# EAGLE design OBD-UART (EAGLE 9.6.2)
DESCRIPTION: microOBD 200 OBD-II Module; HW_REV: 1.4; PCB_REV: C; PCB_SPEC1: Layer Count: 4; PCB_SPEC2: Size: 1.3" x 0.59"; PCB_SPEC3: Finish Thickness: 0.049" - 0.052"; PCB_SPEC4: Copper Weight: 1oz; TITLE: STM1120

## Sheet 1 of 4
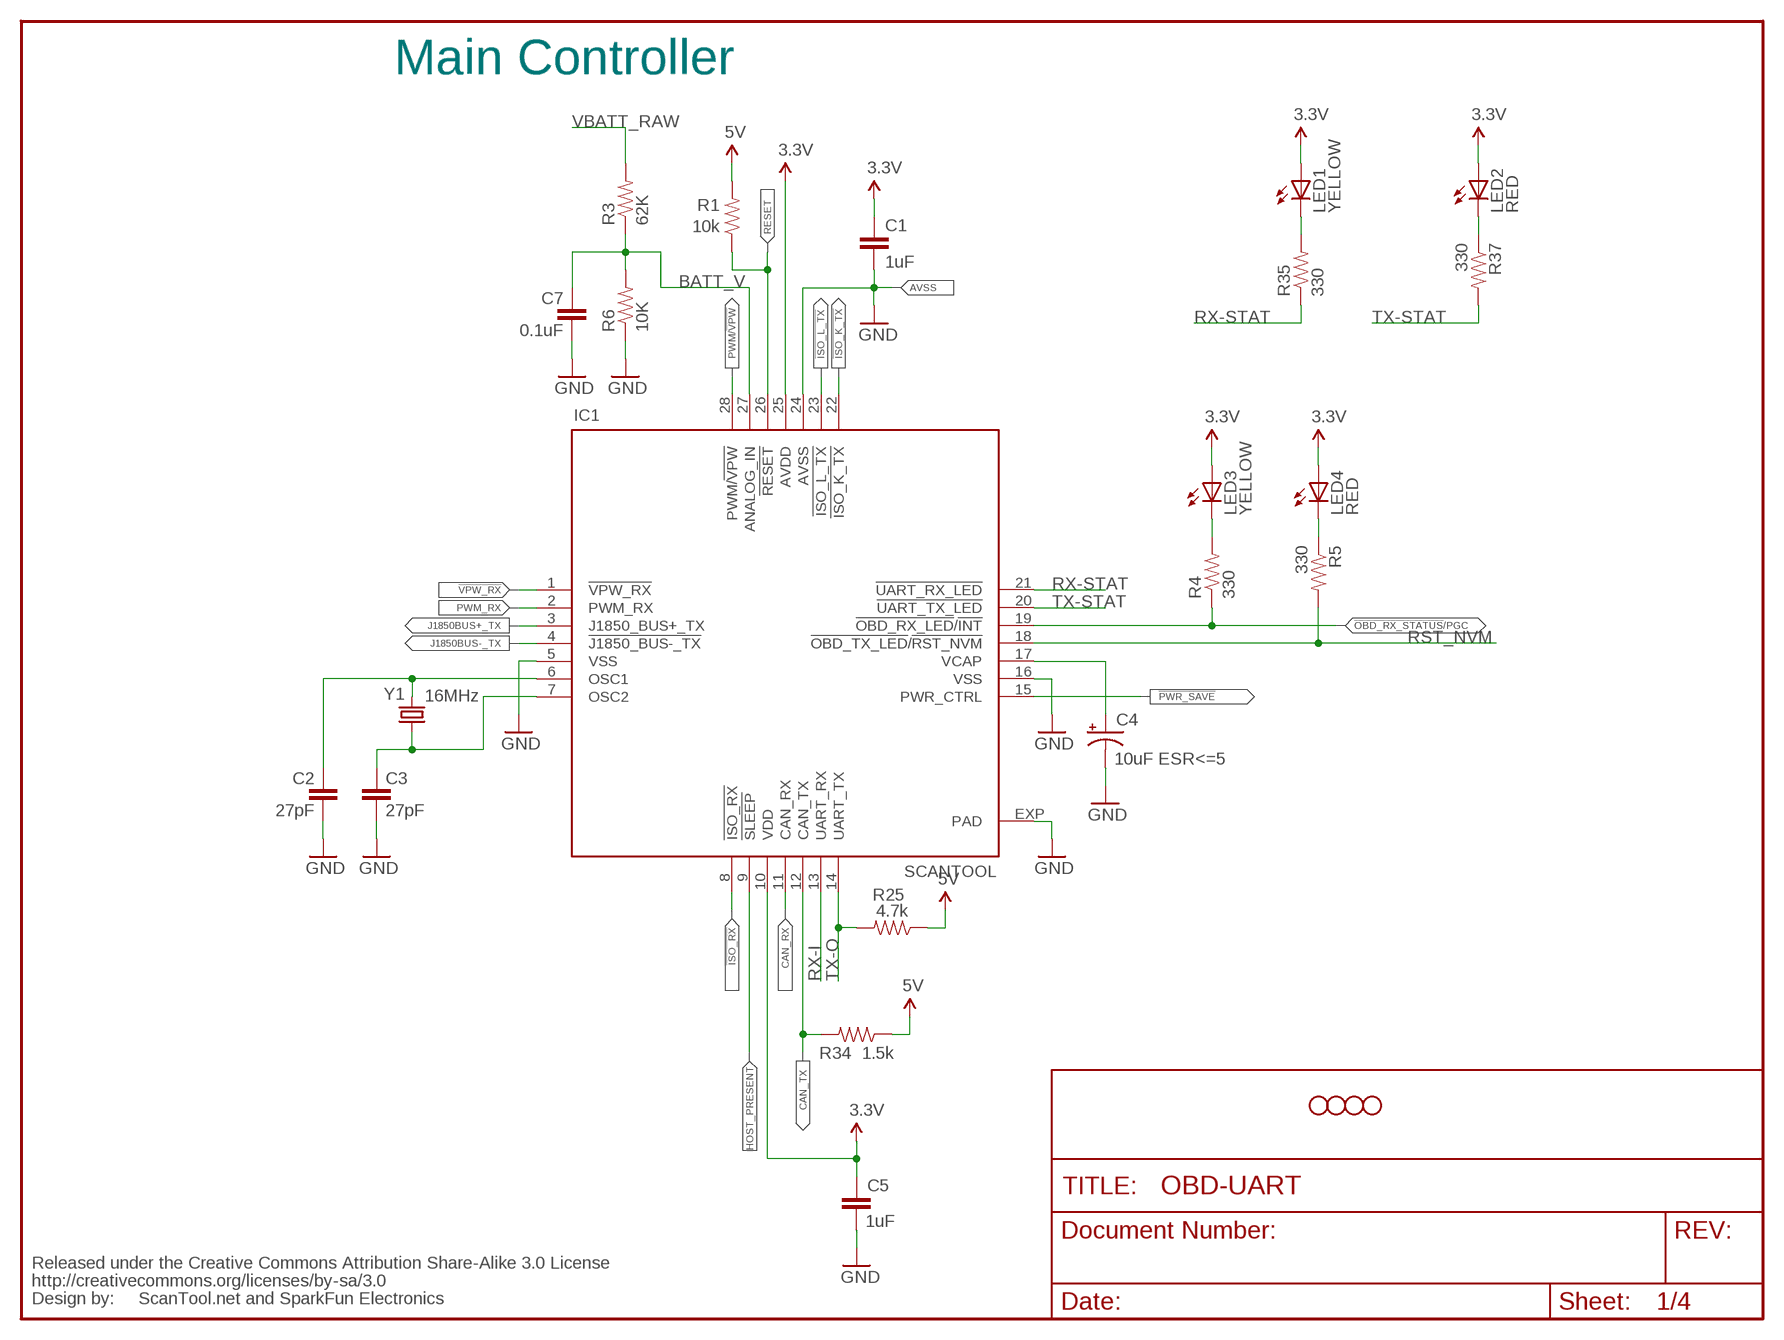
[diagram p0: schematic, sheet 1]

### Parts
C1  1uF  CAP0402-CAP  [0402-CAP]
C2  27pF  CAP0402-CAP  [0402-CAP]
C3  27pF  CAP0402-CAP  [0402-CAP]
C4  10uF ESR<=5  CAP_POL1206  [EIA3216]
C5  1uF  CAP0402-CAP  [0402-CAP]
C7  0.1uF  CAP0402-CAP  [0402-CAP]
IC1  SCANTOOL  [_STN_SCANTOOL_QFN-28-S]
JP4  STAND-OFF  [STAND-OFF]
JP5  STAND-OFF  [STAND-OFF]
JP6  STAND-OFF  [STAND-OFF]
JP7  STAND-OFF  [STAND-OFF]
LED1  YELLOW  LED0603  [LED-0603]
LED2  RED  LED0603  [LED-0603]
LED3  YELLOW  LED0603  [LED-0603]
LED4  RED  LED0603  [LED-0603]
R1  10k  RESISTOR0402-RES  [0402-RES]
R3  62K  RESISTOR0402-RES  [0402-RES]
R4  330  RESISTOR0402-RES  [0402-RES]
R5  330  RESISTOR0402-RES  [0402-RES]
R6  10K  RESISTOR0402-RES  [0402-RES]
R25  4.7k  RESISTOR0402-RES  [0402-RES]
R34  1.5k  RESISTOR0402-RES  [0402-RES]
R35  330  RESISTOR0402-RES  [0402-RES]
R37  330  RESISTOR0402-RES  [0402-RES]
U$1  CREATIVE_COMMONS  [CREATIVE_COMMONS]
Y1  16MHz  CRYSTAL5X3  [CRYSTAL-SMD-5X3]

### Nets
3.3V [highpower]: C1.1 C5.1 IC1.10(VDD) IC1.25(AVDD) LED1.A LED2.A LED3.A LED4.A ; also sheet 2,3,4
5V [highpower]: R1.2 R25.1 R34.1 ; also sheet 2,3,4
!ISO_K_TX: IC1.22(!ISO_K_TX) ; also sheet 3
!ISO_L_TX: IC1.23(!ISO_L_TX) ; also sheet 3
!ISO_RX: IC1.8(!ISO_RX) ; also sheet 3
!OBD_RX_STATUS!/PGC: IC1.19(!OBD_RX_LED!/!INT) R4.1
!PWR_SAVE: IC1.15(PWR_CTRL)
!VPW_RX: IC1.1(!VPW_RX) ; also sheet 4
BATT_V [highpower]: C7.1 IC1.27(ANALOG_IN) R3.1 R6.2
CAN_RX: IC1.11(CAN_RX) ; also sheet 3
CAN_TX: IC1.12(CAN_TX) R34.2 ; also sheet 3
GND: C1.2 C2.2 C3.2 C4.C(-) C5.2 C7.2 IC1.5(VSS) IC1.16(VSS) IC1.24(AVSS) IC1.EXP(PAD) R6.1 ; also sheet 2,3,4
HOST_PRESENT: IC1.9(!SLEEP)
J1850BUS+_TX: IC1.3(J1850_BUS+_TX) ; also sheet 4
J1850BUS-_TX: IC1.4(!J1850_BUS-_TX) ; also sheet 4
N$26: C4.A(+) IC1.17(VCAP)
N$30: LED3.C R4.2
N$31: LED4.C R5.1
N$35: LED1.C R35.2
N$36: LED2.C R37.1
OSC1: C2.1 IC1.6(OSC1) Y1.3
OSC2: C3.1 IC1.7(OSC2) Y1.1
PWM/!VPW: IC1.28(PWM/!VPW) ; also sheet 4
PWM_RX: IC1.2(PWM_RX) ; also sheet 4
RESET: IC1.26(!RESET) R1.1
RST_NVM: IC1.18(!OBD_TX_LED!/!RST_NVM) R5.2
RX-I: IC1.13(UART_RX) ; also sheet 2
RX-STAT: IC1.21(!UART_RX_LED) R35.1
TX-O: IC1.14(UART_TX) R25.2 ; also sheet 2
TX-STAT: IC1.20(!UART_TX_LED) R37.2
VBATT_RAW [highpower]: R3.2 ; also sheet 2

### Notes on the sheet
- Main Controller
- AVSS
- ScanTool.net and SparkFun Electronics

## Sheet 2 of 4
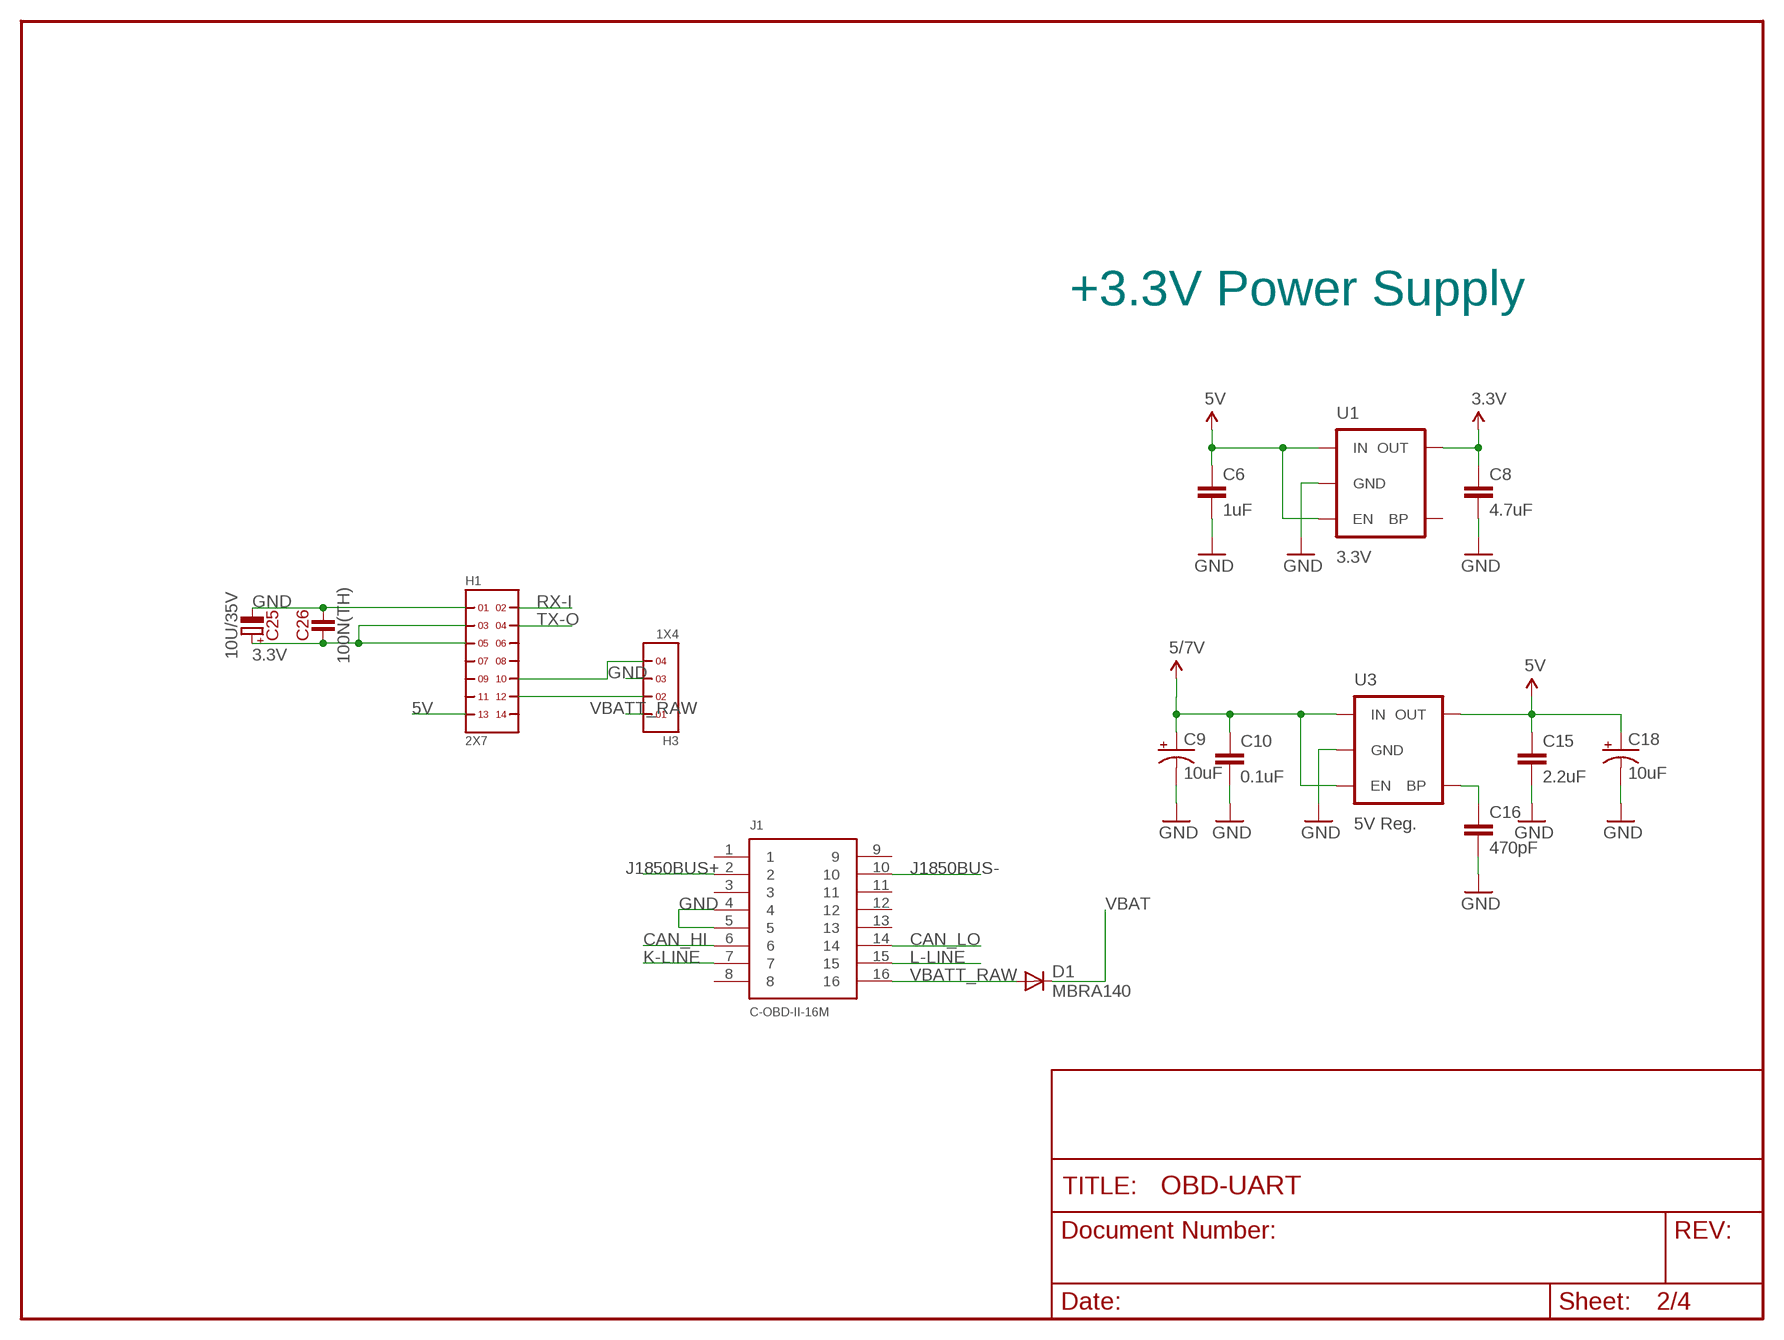
[diagram p1: schematic, sheet 2]

### Parts
C6  1uF  CAP0402-CAP  [0402-CAP]
C8  4.7uF  CAP0402-CAP  [0402-CAP]
C9  10uF  CAP_POL1206  [EIA3216]
C10  0.1uF  CAP0402-CAP  [0402-CAP]
C15  2.2uF  CAP0402-CAP  [0402-CAP]
C16  470pF  CAP0402-CAP  [0402-CAP]
C18  10uF  CAP_POL1206  [EIA3216]
C25  10U/35V  [E2-5]
C26  100N(TH)  [C050-024X044]
D1  MBRA140  DIODESMA  [SMA-DIODE]
H1  2X7  [2X7]
H3  1X4  [1X4]
J1  C-OBD-II-16M  [COMTECH_C-OBD-II-16M]
U1  3.3V  V_REG_LDOSMD  [SOT23-5]
U3  5V Reg.  V_REG_LDOSMD  [SOT23-5]

### Nets
3.3V [highpower]: C8.1 C25.+ C26.1 H1.3 H1.5 U1.5(OUT) ; also sheet 1,3,4
5V [highpower]: C6.1 C15.1 C18.A(+) H1.13 U1.1(IN) U1.3(EN) U3.5(OUT) ; also sheet 1,3,4
CAN_HI: J1.6 ; also sheet 3
CAN_LO: J1.14 ; also sheet 3
GND: C6.2 C8.2 C9.C(-) C10.2 C15.2 C16.2 C18.C(-) C25.- C26.2 H1.1 H3.3 J1.4 J1.5 U1.2(GND) U3.2(GND) ; also sheet 1,3,4
J1850BUS+: J1.2 ; also sheet 4
J1850BUS-: J1.10 ; also sheet 4
K-LINE: J1.7 ; also sheet 3
L-LINE: J1.15 ; also sheet 3
N$17: H1.10 H3.4
N$20: H1.12 H3.2
N$34: C16.1 U3.4(BP)
RX-I: H1.2 ; also sheet 1
TX-O: H1.4 ; also sheet 1
VBAT [highpower]: D1.C ; also sheet 3,4
VBATT_RAW [highpower]: D1.A H3.1 J1.16 ; also sheet 1
VCC [highpower]: C9.A(+) C10.1 U3.1(IN) U3.3(EN) ; supply symbol labelled 5/7V ; also sheet 4
Unconnected: H1.6 H1.7 H1.8 H1.9 H1.11 H1.14 J1.1 J1.3 J1.8 J1.9 J1.11 J1.12 J1.13 U1.4(BP)

### Notes on the sheet
- +3.3V Power Supply

## Sheet 3 of 4
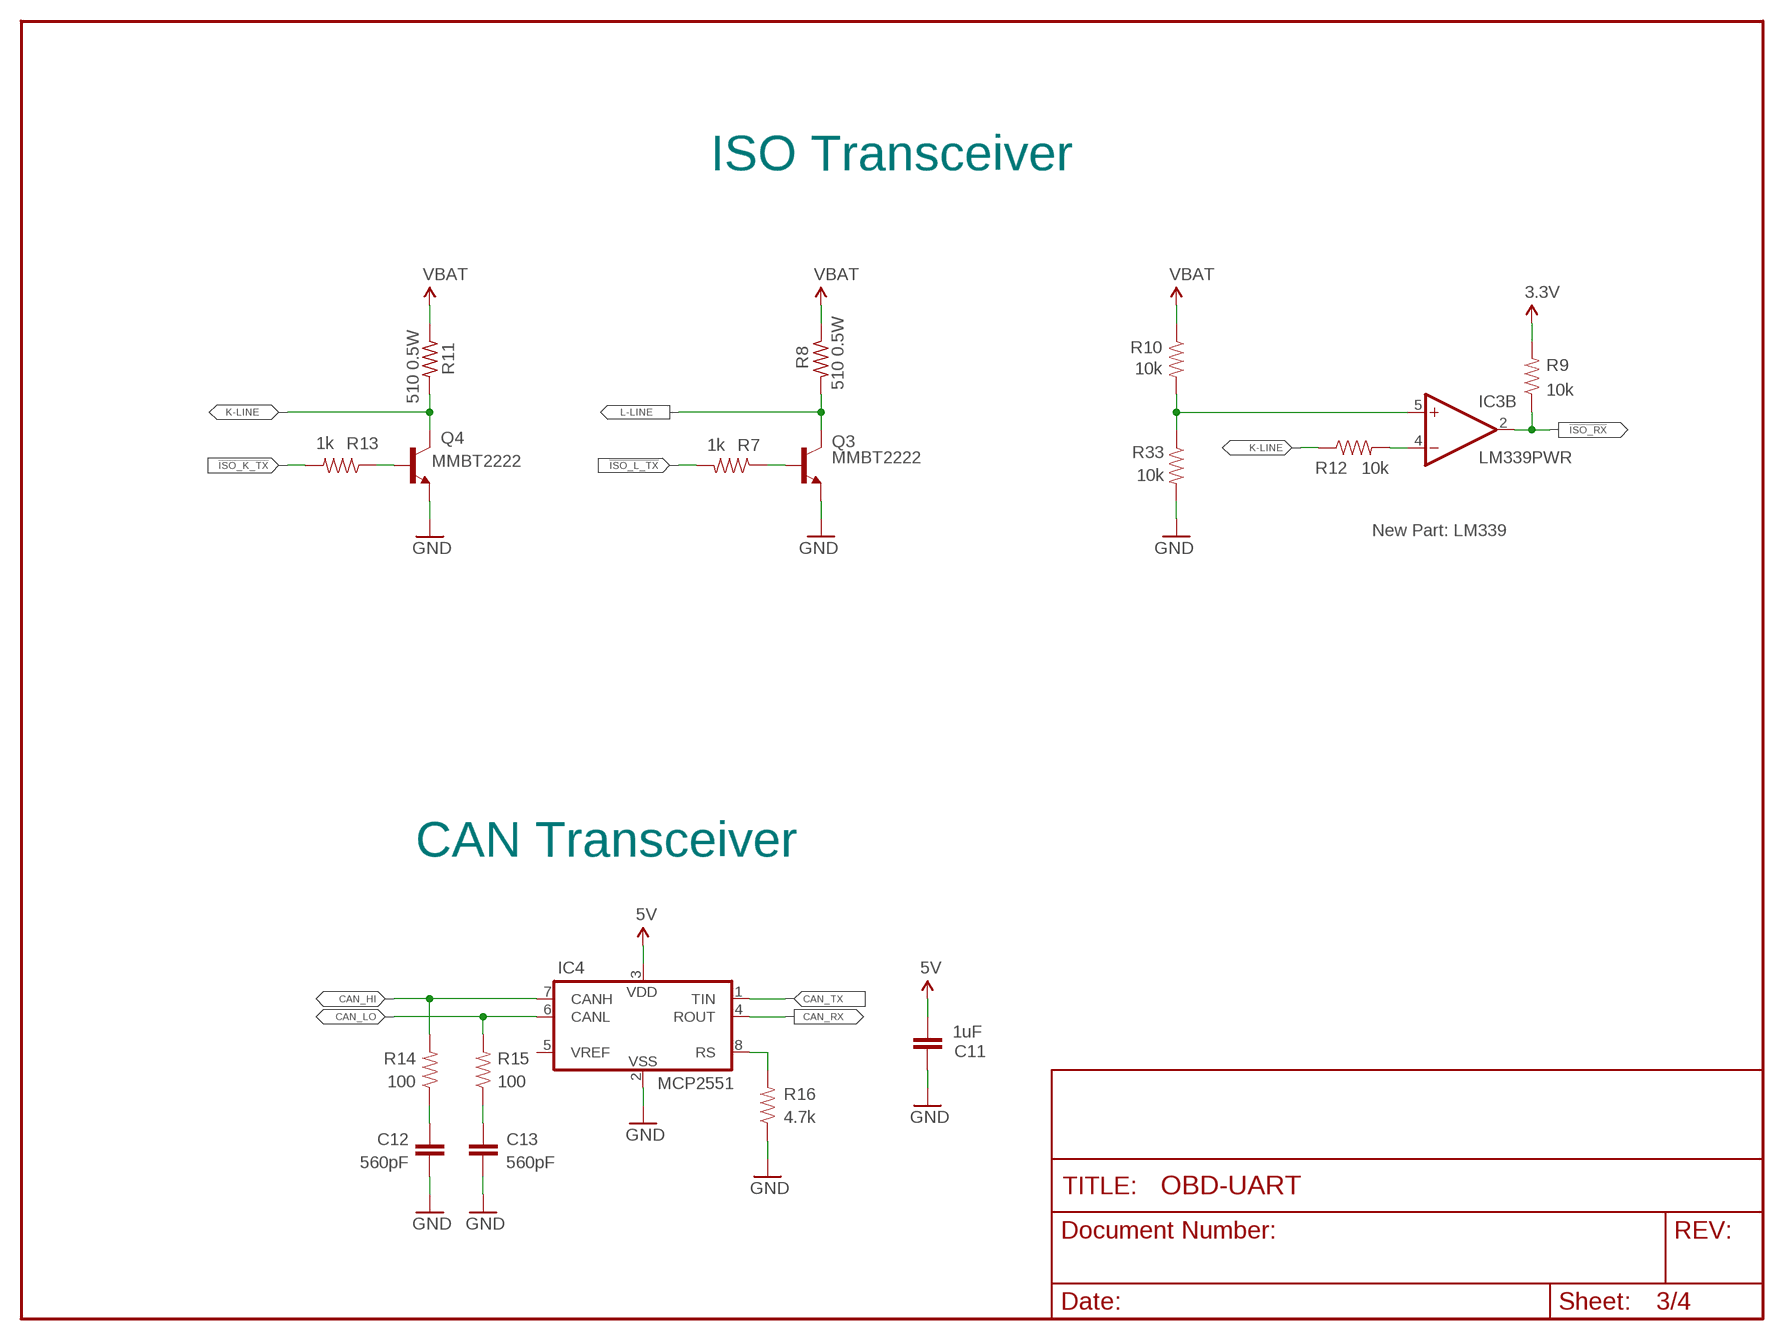
[diagram p2: schematic, sheet 3]

### Parts
C11  1uF  CAP0402-CAP  [0402-CAP]
C12  560pF  CAP0402-CAP  [0402-CAP]
C13  560pF  CAP0402-CAP  [0402-CAP]
IC3  LM339PWR  [TSSOP-14]
IC4  MCP2551  MCP2551-I/SN  [SO-8]
Q3  MMBT2222  TRANSISTOR_NPNSOT23-3  [SOT23-3]
Q4  MMBT2222  TRANSISTOR_NPNSOT23-3  [SOT23-3]
R7  1k  RESISTOR0402-RES  [0402-RES]
R8  510 0.5W  R-US_2010  [2010]
R9  10k  RESISTOR0402-RES  [0402-RES]
R10  10k  RESISTOR0402-RES  [0402-RES]
R11  510 0.5W  R-US_2010  [2010]
R12  10k  RESISTOR0402-RES  [0402-RES]
R13  1k  RESISTOR0402-RES  [0402-RES]
R14  100  RESISTOR0402-RES  [0402-RES]
R15  100  RESISTOR0402-RES  [0402-RES]
R16  4.7k  RESISTOR0402-RES  [0402-RES]
R33  10k  RESISTOR0402-RES  [0402-RES]

### Nets
3.3V [highpower]: R9.2 ; also sheet 1,2,4
5V [highpower]: C11.1 IC4.3(VDD) ; also sheet 1,2,4
!ISO_K_TX: R13.2 ; also sheet 1
!ISO_L_TX: R7.2 ; also sheet 1
!ISO_RX: IC3.2(B:OUT) R9.1 ; also sheet 1
CAN_HI: IC4.7(CANH) R14.2 ; also sheet 2
CAN_LO: IC4.6(CANL) R15.2 ; also sheet 2
CAN_RX: IC4.4(ROUT) ; also sheet 1
CAN_TX: IC4.1(TIN) ; also sheet 1
GND: C11.2 C12.2 C13.2 IC4.2(VSS) Q3.2(E) Q4.2(E) R16.1 R33.2 ; also sheet 1,2,4
K-LINE: Q4.3(C) R11.2 R12.1 ; also sheet 2
L-LINE: Q3.3(C) R8.2 ; also sheet 2
N$4: Q4.1(B) R13.1
N$5: Q3.1(B) R7.1
N$6: IC3.5(B:+IN) R10.2 R33.1
N$10: C12.1 R14.1
N$11: IC4.8(RS) R16.2
N$13: IC3.4(B:-IN) R12.2
N$27: C13.1 R15.1
VBAT [highpower]: R8.1 R10.1 R11.1 ; also sheet 2,4
Unconnected: IC3.10(D:-IN) IC3.11(D:+IN) IC3.13(D:OUT) IC4.5(VREF)

### Notes on the sheet
- ISO Transceiver
- New Part: LM339
- CAN Transceiver

## Sheet 4 of 4
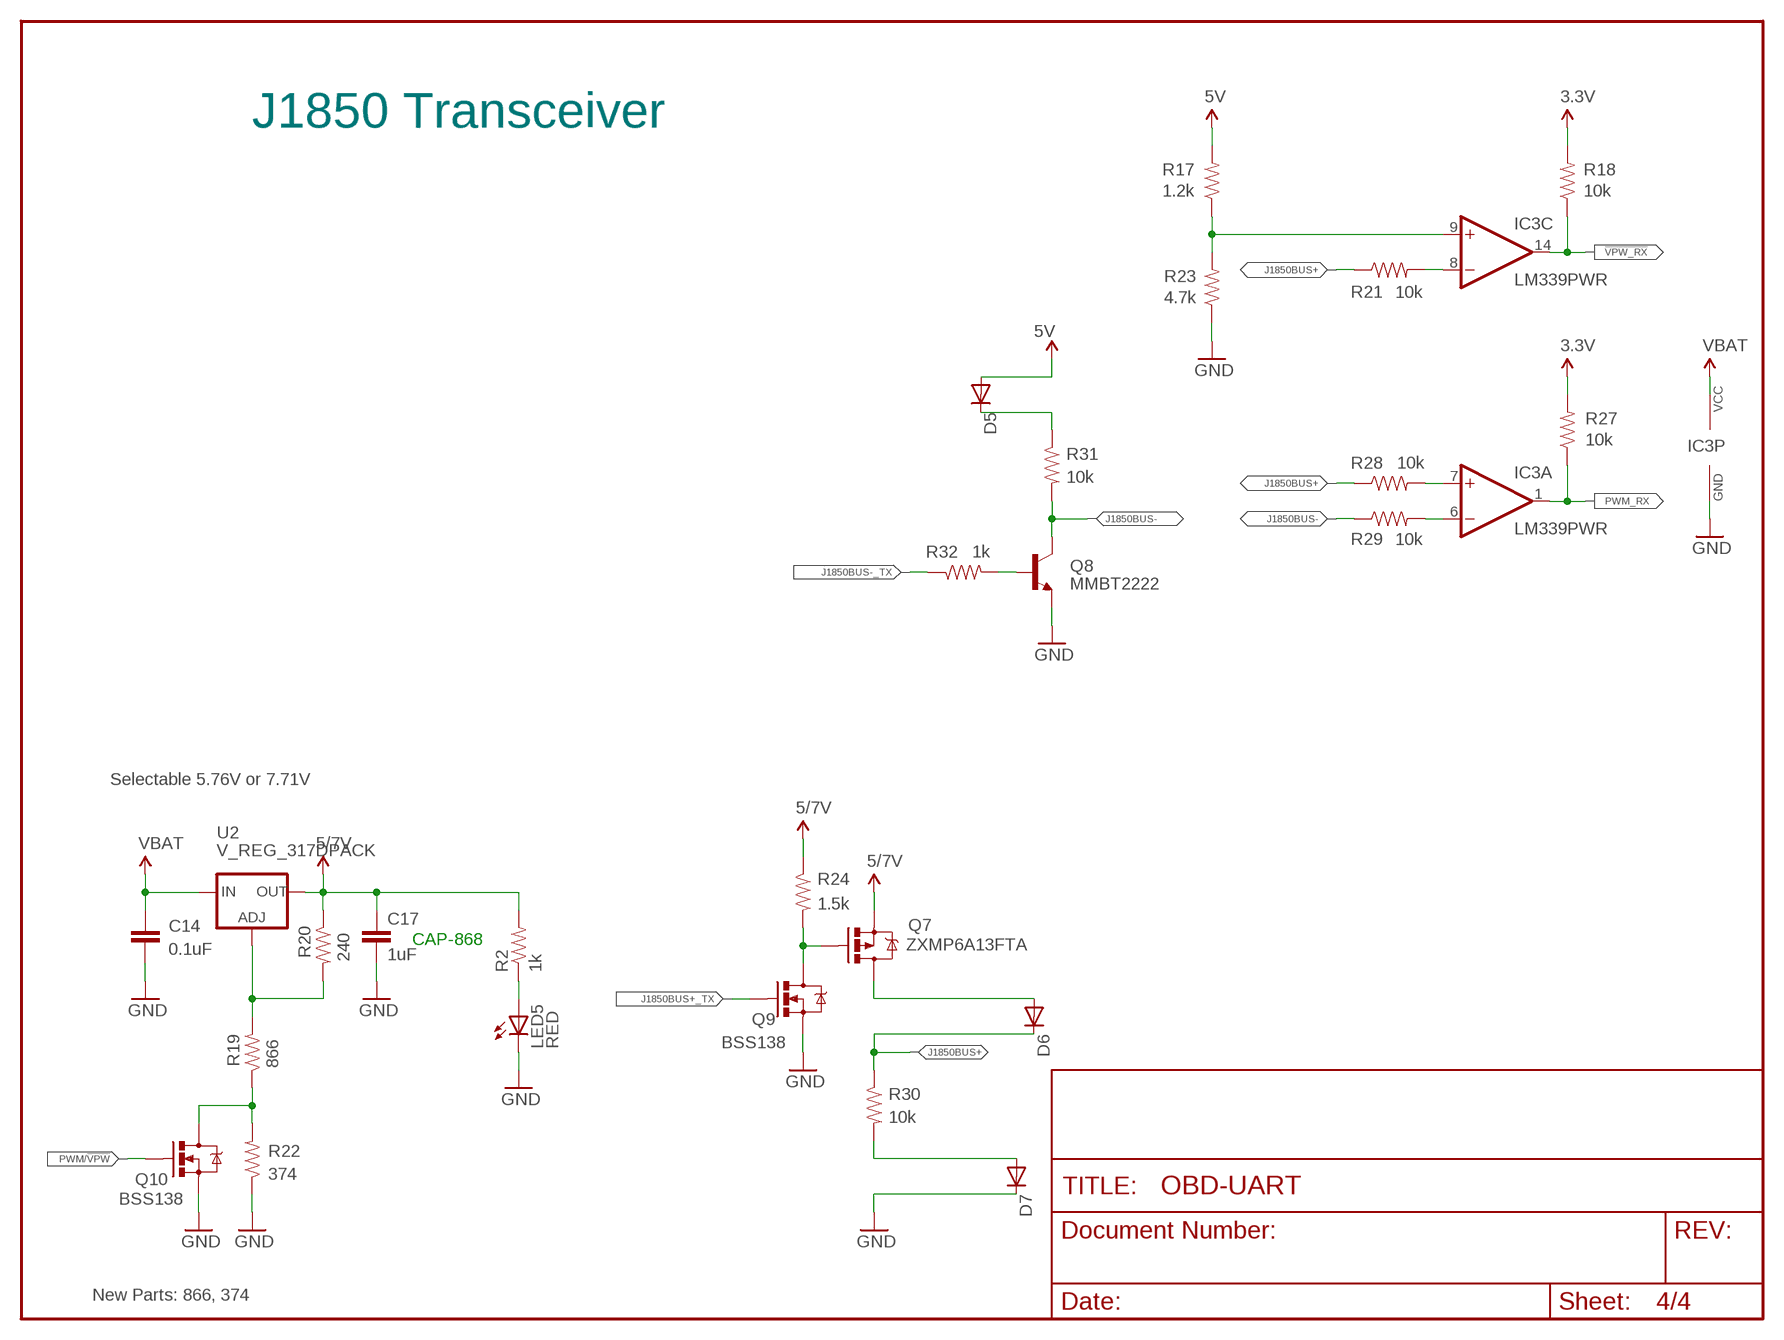
[diagram p3: schematic, sheet 4]

### Parts
C14  0.1uF  CAP0402-CAP  [0402-CAP]
C17  1uF  CAP0402-CAP  [0402-CAP]
D5  DIODESOT23  [SOT23-3]
D6  DIODESOT23  [SOT23-3]
D7  DIODESOT23  [SOT23-3]
LED5  RED  LED0603  [LED-0603]
Q7  ZXMP6A13FTA  MOSFET-PCHANNEL  [SOT23]
Q8  MMBT2222  TRANSISTOR_NPNSOT23-3  [SOT23-3]
Q9  BSS138  MOSFET-NCHANNELSMD  [SOT23-3]
Q10  BSS138  MOSFET-NCHANNELSMD  [SOT23-3]
R2  1k  RESISTOR0402-RES  [0402-RES]
R17  1.2k  RESISTOR0402-RES  [0402-RES]
R18  10k  RESISTOR0402-RES  [0402-RES]
R19  866  RESISTOR0402-RES  [0402-RES]
R20  240  RESISTOR0402-RES  [0402-RES]
R21  10k  RESISTOR0402-RES  [0402-RES]
R22  374  RESISTOR0402-RES  [0402-RES]
R23  4.7k  RESISTOR0402-RES  [0402-RES]
R24  1.5k  RESISTOR0402-RES  [0402-RES]
R27  10k  RESISTOR0402-RES  [0402-RES]
R28  10k  RESISTOR0402-RES  [0402-RES]
R29  10k  RESISTOR0402-RES  [0402-RES]
R30  10k  RESISTOR0402-RES  [0402-RES]
R31  10k  RESISTOR0402-RES  [0402-RES]
R32  1k  RESISTOR0402-RES  [0402-RES]
U2  V_REG_317DPACK  [V-REG_DPACK]

### Nets
3.3V [highpower]: R18.2 R27.2 ; also sheet 1,2,3
5V [highpower]: D5.1(A) R17.2 ; also sheet 1,2,3
!VPW_RX: IC3.14(C:OUT) R18.1 ; also sheet 1
GND: C14.2 C17.2 D7.3(C) IC3.12(P:GND) LED5.C Q8.2(E) Q9.2(S) Q10.2(S) R22.1 R23.1 ; also sheet 1,2,3
J1850BUS+: D6.3(C) R21.1 R28.1 R30.1 ; also sheet 2
J1850BUS+_TX: Q9.1(G) ; also sheet 1
J1850BUS-: Q8.3(C) R29.1 R31.2 ; also sheet 2
J1850BUS-_TX: R32.1 ; also sheet 1
N$1: IC3.7(A:+IN) R28.2
N$3: IC3.6(A:-IN) R29.2
N$7: IC3.8(C:-IN) R21.2
N$8: R19.2 R20.2 U2.1(ADJ)
N$9: D6.1(A) Q7.3(D)
N$12: IC3.9(C:+IN) R17.1 R23.2
N$14: D5.3(C) R31.1
N$18: Q7.1(G) Q9.3(D) R24.2
N$22: Q10.3(D) R19.1 R22.2
N$24: D7.1(A) R30.2
N$25: Q8.1(B) R32.2
N$32: LED5.A R2.1
PWM/!VPW: Q10.1(G) ; also sheet 1
PWM_RX: IC3.1(A:OUT) R27.1 ; also sheet 1
VBAT [highpower]: C14.1 IC3.3(P:VCC) U2.3(IN) ; also sheet 2,3
VCC [highpower]: C17.1 Q7.2(S) R2.2 R20.1 R24.1 U2.4(OUT) ; supply symbol labelled 5/7V ; also sheet 2

### Notes on the sheet
- J1850 Transceiver
- Selectable 5.76V or 7.71V
- CAP-868
- New Parts: 866, 374

## Library data of the parts
C1-C3 C5-C8 C10-C17 = SparkFun:CAP: Capacitor Standard 0603 ceramic capacitor, and 0.1" leaded capacitor.
C4 C9 C18 = SparkFun:CAP_POL: Capacitor Polarized These are standard SMD and PTH capacitors. Normally 10uF, 47uF, and 100uF in electrolytic and tantalum varieties. Always verify the external diameter of the through hole cap, it varies with capacity, voltage, and manufacturer. The EIA devices should be standard.
C25 = capacitors-electrolytic:?; MOUSER: 647-USW1V100MDD
C26 = capacitors:?; MOUSER: 81-RCER71H104K0A2H3B
D1 D5-D7 = SparkFun:DIODE: Diode These are standard reverse protection diodes and small signal diodes. SMA package can handle up to about 1A. SOD-323 can handle about 200mA. What the SOD-323 package when ordering, there are some mfgs out there that are 5-pin packages.
H1 = headers(.1in):2X7
H3 = headers(.1in):1X4
IC1 = SparkFun:SCANTOOL: STN1110 - Multiprotocol OBD II to UART Interpreter, QFN Package Change Log Date Author Change Aug 23, 2010 vit@scantool.net Created device
IC3 = _stn_logic:LM339PWR: Quad Differential Comparators Based on information from the SLCS006N datasheet from TI (www.ti.com). Change Log Date Author Change July 16, 2008 nick@scantool.net Device created.; DESC: IC, Quad Comparator; MANUF: Texas Instruments; PARTNUM: LM339PWR; SUPPLIER: Digikey:296-6607-1-ND; VALSTAT: PARTNUM
IC4 = _stn_microchip:MCP2551: CAN Driver Based on information from the MPC2551 datasheet from Microchip. http://www.microchip.com/ Change Log Date Author Change November 12, 2008 joe@scantool.net Renamed "TXD" to "TIN" and "RXD" to "ROUT" Fixed mislabeled pins "CANH" and CANL"; DESC: IC, CAN Transceiver; MANUF: Microchip Technology; PARTNUM: MCP2551-I/SN; SUPPLIER: Digikey:MCP2551-I/SN-ND; VALSTAT: PARTNUM
J1 = C-OBD-II-16M:C-OBD-II-16M: OBD II 16pin 90 Degree Angle Male Plug Connector Check availability <https://pricing.snapeda.com/parts/C-OBD-II-16M/Comtech%20Electronic%20Co.%2C%20LTD/view-part?ref=eda>; AVAILABILITY: Not in stock; DESCRIPTION: OBD II 16pin 90 Degree Angle Male Plug Connector; MF: Comtech Electronic Co., LTD; MP: C-OBD-II-16M; PACKAGE: None; PRICE: None
JP4-JP7 = SparkFun:STAND-OFF: Stand Off This is the mechanical footprint for a #4 phillips button head screw. Use the keepout ring to avoid running the screw head into surrounding components. SKU : PRT-00447
LED1-LED5 = SparkFun:LED: LEDs Standard schematic elements and footprints for 5mm, 3mm, 1206, and 0603 sized LEDs. 5mm - Spark Fun Electronics SKU : COM-00529 (and others)
Q3 Q4 Q8 = SparkFun:TRANSISTOR_NPN: Transistor NPN BJT configuration in SOT23 package. MMBT2222 is the common NPN we use. Double check BCE configuration again layout.
Q7 = SparkFun:MOSFET-PCHANNEL
Q9 Q10 = SparkFun:MOSFET-NCHANNEL
R1-R7 R9 R10 R12-R25 R27-R35 R37 = SparkFun:RESISTOR: Resistor Basic schematic elements and footprints for 0603, 1206, and PTH resistors.
R8 R11 = _stn_rcl:R-US: Resistor, US Symbol Change Log Date Author Change November 13, 2006 vit@scantool.net Moved underscore from the end of device name to beginning of variant names. May 27, 2006 vitaliy@scantool.net Added description.; DESC: Resistor; VALSTAT: VAL
U1 U3 = SparkFun:V_REG_LDO: Voltage Regulator LDO Standard 150mA LDO voltage regulator in SOT-23 layout. Micrel part MIC5205. BP (by-pass) pin is used to lower output noise with 470pF cap.
U2 = SparkFun:V_REG_317: Voltage Regulator Standard LM317 adjustable voltage regulator. AOI (Adjust Output Input). Google 'LM317 Calculator' for easy to use app to get the two resistor values needed. 240/720 for 5V output. 240/390 for 3.3V output. Spark Fun Electronics SKU : COM-00527
U$1 = SparkFun:CREATIVE_COMMONS
Y1 = SparkFun:CRYSTAL: Crystals Various standard crystals. Proven footprints. Spark Fun Electronics SKU : COM-00534

## Net classes
1 highpower: width 0.305 mm

## Board
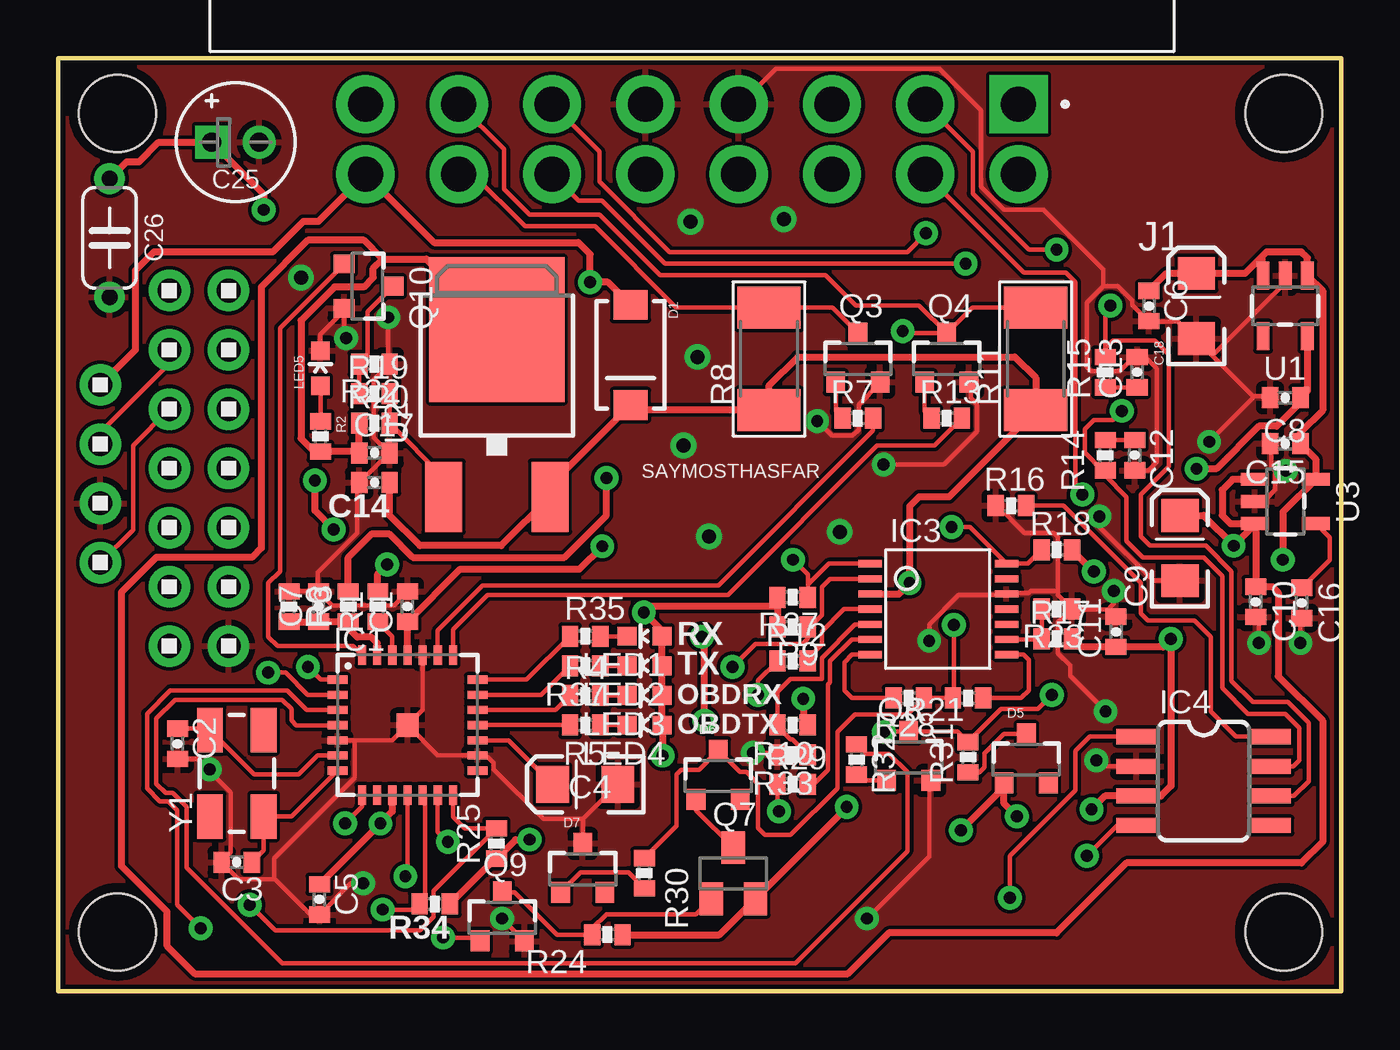
[diagram p4: board, top side]
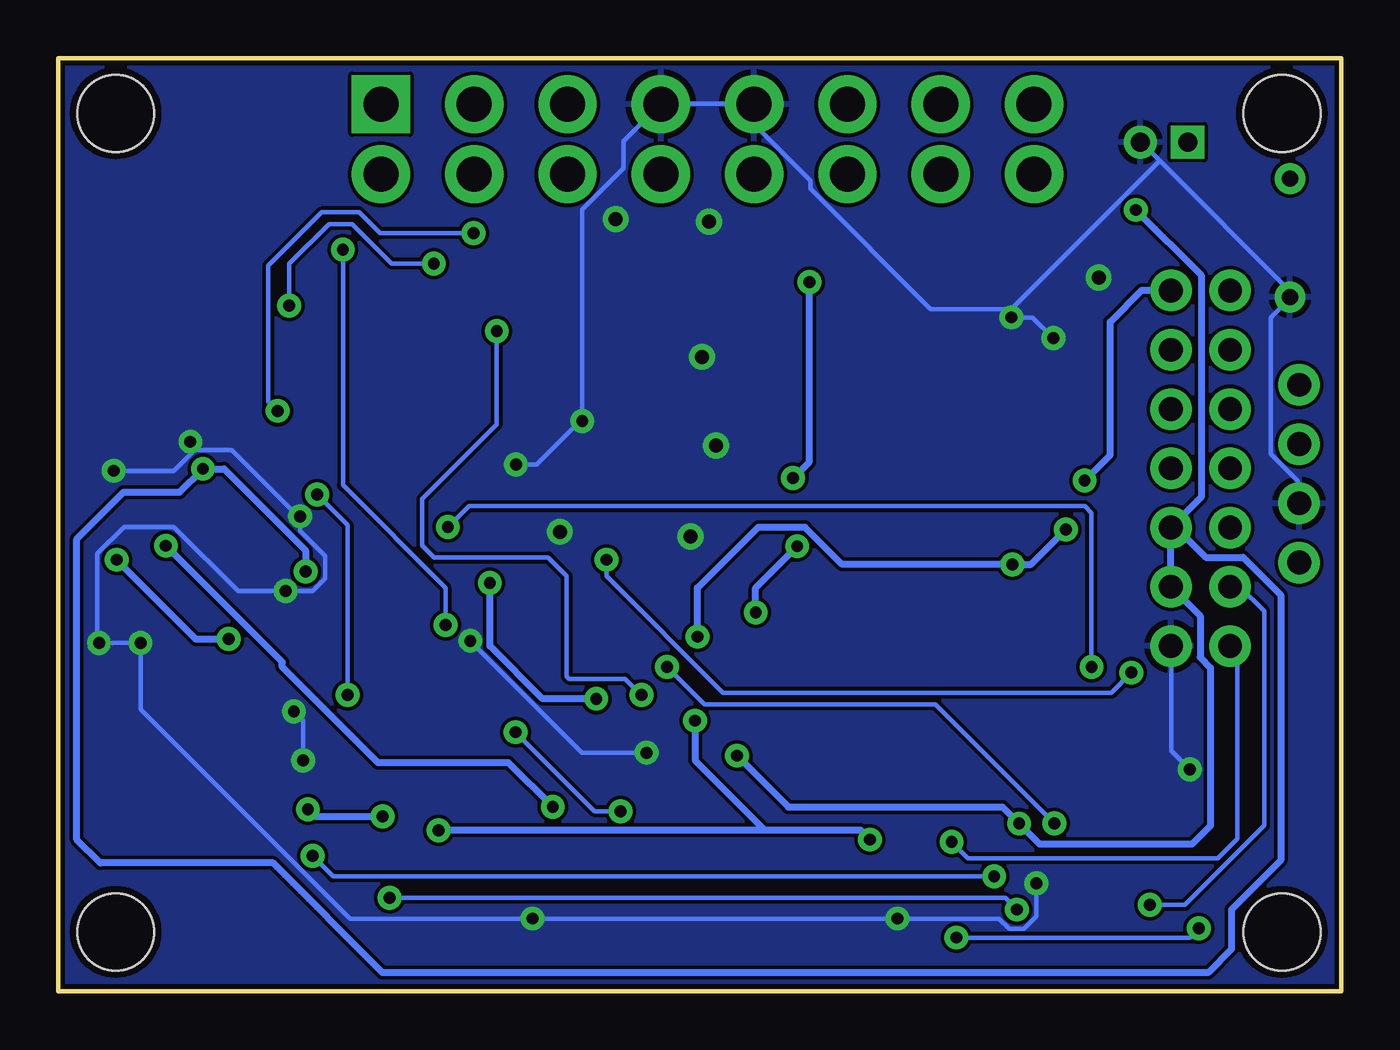
[diagram p5: board, bottom side, seen from below]

Size 55 x 40 mm. Coordinates in mm from the lower left corner, seen from the top.
Outline: 0,0 55,0 55,40 0,40 0,0
Copper layers (1*16): Top 0.035mm / dielectric 1.5mm / Bottom 0.035mm
Design rules "SparkFun *": minimum track width 8mil, minimum drill 20mil, track to track 6mil, track to pad 6mil, pad to pad 6mil, via to via 6mil, smd to smd 6mil, copper to edge 8mil, drill to drill 8mil, minimum pad ring 12mil, minimum via ring 10mil, stop-mask expansion 4mil, vias tented up to drill 20mil, thermal gap 10mil
Milling: 4 lines

### Footprints (pad centres in the part's own frame; a part is rotated, then mirrored left to right if it is on the bottom)
0402-CAP = smd 0.7 x 0.9: 1 -0.65,0; 2 0.65,0
EIA3216 = smd 1.4 x 1.6: A 1.4,0; C -1.4,0
E2-5 = drill 0.813 square: + -1.016,0 | drill 0.813: - 1.016,0
C050-024X044 = drill 0.7: 1 -2.54,0; 2 2.54,0
SMA-DIODE = smd 1.27 x 1.47: A -2.15,0; C 2.15,0
SOT23-3 = smd 0.8 x 0.9: 1 -0.95,-1; 2 0.95,-1; 3 0,1.1
2X7 = drill 1.016 pad 1.778: 1 0,0; 2 0,2.54; 3 2.54,0; 4 2.54,2.54; 5 5.08,0; 6 5.08,2.54; 7 7.62,0; 8 7.62,2.54; 9 10.16,0; 10 10.16,2.54; 11 12.7,0; 12 12.7,2.54; 13 15.24,0; 14 15.24,2.54
1X4 = drill 1.016 pad 1.778: 1 0,0; 2 2.54,0; 3 5.08,0; 4 7.62,0
_STN_SCANTOOL_QFN-28-S = smd 0.85 x 0.35: 1 -3,1.95; 2 -3,1.3; 3 -3,0.65; 4 -3,0; 5 -3,-0.65; 6 -3,-1.3; 7 -3,-1.95; 15 3,-1.95; 16 3,-1.3; 17 3,-0.65; 18 3,0; 19 3,0.65; 20 3,1.3; 21 3,1.95 | smd 0.35 x 0.85: 8 -1.95,-3; 9 -1.3,-3; 10 -0.65,-3; 11 0,-3; 12 0.65,-3; 13 1.3,-3; 14 1.95,-3; 22 1.95,3; 23 1.3,3; 24 0.65,3; 25 0,3; 26 -0.65,3; 27 -1.3,3; 28 -1.95,3 | smd 1 x 1: EXP 0,0
TSSOP-14 = smd 0.305 x 0.991: 1 -1.95,-2.925; 2 -1.3,-2.925; 3 -0.65,-2.925; 4 0,-2.925; 5 0.65,-2.925; 6 1.3,-2.925; 7 1.95,-2.925; 8 1.95,2.925; 9 1.3,2.925; 10 0.65,2.925; 11 0,2.925; 12 -0.65,2.925; 13 -1.3,2.925; 14 -1.95,2.925
SO-8 = smd 0.65 x 1.75: 1 -1.905,-2.873; 2 -0.635,-2.873; 3 0.635,-2.873; 4 1.905,-2.873; 5 1.905,2.873; 6 0.635,2.873; 7 -0.635,2.873; 8 -1.905,2.873
COMTECH_C-OBD-II-16M = drill 1.5 pad 2.5 square: 1 0,0 | drill 1.5 pad 2.5: 2 4,0; 3 8,0; 4 12,0; 5 16,0; 6 20,0; 7 24,0; 8 28,0; 9 0,3; 10 4,3; 11 8,3; 12 12,3; 13 16,3; 14 20,3; 15 24,3; 16 28,3
STAND-OFF = hole 3.302: 0,0
LED-0603 = smd 0.8 x 0.8: A 0,-0.75; C 0,0.75
SOT23 = smd 1 x 1.4: 1 -0.95,-1.1; 2 0.95,-1.1; 3 0,1.1
0402-RES = smd 0.7 x 0.9: 1 -0.65,0; 2 0.65,0
2010 = smd 1.8 x 2.7: 1 -2.2,0; 2 2.2,0
SOT23-5 = smd 0.55 x 1.2: 1 -0.95,-1.3; 2 0,-1.3; 3 0.95,-1.3; 4 0.95,1.3; 5 -0.95,1.3
V-REG_DPACK = smd 1.6 x 3: 1 -2.28,-4.8; 3 2.28,-4.8 | smd 5.8 x 6.2: 4 0,2.38
CRYSTAL-SMD-5X3 = smd 1.9 x 1.1: 1 -1.85,-1.15; 2 1.85,-1.15; 3 1.85,1.15; 4 -1.85,1.15

### Placement (x,y rotation side)
C1  14.97,16.49 90 top
C2  5.11,10.61 270 top
C3  7.65,5.53 180 top
C4  22.59,8.87 180 top
C5  11.2,3.93 270 top
C6  46.76,29.38 270 top
C7  11.16,16.49 90 top
C8  52.6,25.45 180 top
C9  48.09,19 90 top
C10  51.33,16.7 270 top
C11  45.35,15.41 90 top
C12  46.15,22.98 270 top
C13  46.25,26.54 90 top
C14  13.55,21.81 180 top
C15  52.6,23.48 180 top
C16  53.3,16.65 270 top
C17  13.55,23.08 0 top
C18  48.79,29.38 90 top
C25  7.6,36.4 0 top
C26  2.2,32.3 270 top
D1  24.53,27.28 270 top
D5  41.5,9.93 0 top
D6  28.29,9.23 0 top
D7  22.48,5.23 0 top
H1  7.3,14.8 90 top
H3  1.8,26 270 top
IC1  14.97,11.41 0 top
IC3  37.73,16.38 270 top
IC4  49.1,9.01 270 top
J1  41.17,38.03 180 top
JP4  2.54,2.54 0 top
JP5  52.54,37.64 0 top
JP6  52.54,2.54 0 top
JP7  2.54,37.64 0 top
LED1  25.13,15.22 90 top
LED2  25.13,13.95 90 top
LED3  25.13,12.68 90 top
LED4  25.13,11.41 90 top
LED5  11.23,26.71 0 top
Q3  34.28,27.11 0 top
Q4  38.09,27.11 0 top
Q7  28.94,5.06 0 top
Q8  36.46,10.03 0 top
Q9  19.03,3.15 0 top
Q10  13.25,30.23 270 top
R1  13.7,16.49 90 top
R2  11.24,23.79 270 top
R3  12.43,16.49 90 top
R4  22.59,12.68 0 top
R5  22.59,11.41 180 top
R6  9.89,16.49 270 top
R7  34.28,24.57 0 top
R8  30.47,27.11 90 top
R9  31.48,15.62 180 top
R10  31.48,11.41 180 top
R11  41.9,27.11 90 top
R12  31.48,14.15 0 top
R13  38.09,24.57 0 top
R14  44.88,22.98 270 top
R15  44.88,26.54 90 top
R16  40.84,20.82 0 top
R17  42.81,15.11 0 top
R18  42.81,18.92 0 top
R19  13.55,25.62 0 top
R20  13.55,24.35 0 top
R21  39,12.57 0 top
R22  13.55,26.89 180 top
R23  42.81,16.38 180 top
R24  23.54,2.42 180 top
R25  18.78,6.33 90 top
R27  31.48,16.89 180 top
R28  36.46,12.57 180 top
R29  31.48,8.87 0 top
R30  25.13,5.06 270 top
R31  39,10.03 90 top
R32  34.22,9.93 270 top
R33  31.48,10.14 180 top
R34  16.14,3.74 180 top
R35  22.59,15.22 0 top
R37  22.59,13.95 180 top
U1  52.6,29.38 180 top
U2  18.8,25.99 0 top
U3  52.6,21 270 top
U$1  20.32,-15.24 0 top  (outside the outline)
Y1  7.65,9.34 90 top

### Tracks (layer width: path | path; a pad name or v marks a point on that pad's centre or on a via)
3.3V  (via drill 0.51)
  Top 0.305: C5.1 v13.81,7.19 14.32,7.7 IC1.10 14.31,8.53 | U1.5 53.55,25.75 C8.1 53.25,25.25 52.23,24.23 51.47,24.23 49.64,22.4 v48.8,22.4 | v44.4,18 44.38,18 R18.2 | IC1.25 C1.1 17.23,18.1 22.34,18.1 v23.32,19.08 | 30.63,15.42 R9.2 30.83,16.5 | R27.2 30.83,16.5 | C26.1 2.93,35.57 3.46,35.57 4.29,36.4 C25.+ 8.8,34.18 v8.8,33.5 | v25.9,10.1 25.9,11.39 LED4.A LED3.A LED2.A LED1.A 25.88,15.46 v25.1,16.24 25.36,16.5 30.83,16.5
  Bottom 0.305: v44.4,18 44.4,18.9 47.9,22.4 v48.8,22.4 49.8,21.4 52.2,21.4 54.2,19.4 54.2,6.5 53.2,5.5 45.8,5.5 41.1,0.8 5.7,0.8 4.7,1.8 4.7,3.5 2.6,5.6 2.6,17 4.2,18.6 5.8,18.6 7.08,19.88 H1.5 | H1.5 6,21.18 6,30.7 v8.8,33.5 | H1.5 H1.3 7.2,17.25 6.04,16.09 6.04,14.31 5.6,13.87 5.6,7.1 6.4,6.3 12.92,6.3 v13.81,7.19 14.52,7.9 23.7,7.9 v25.9,10.1 | v25.1,16.24 25.1,17.3 v23.32,19.08
5V  (via drill 0.51)
  Top 0.305: 51.6,31.5 51.6,30.73 U1.3 | 51.6,31.5 51.8,31.7 53.3,31.7 53.55,31.45 U1.1 54.2,30.03 54.2,24.9 53.25,23.95 C15.1 53.9,22.82 U3.5 52.5,20.55 v52.5,18.5 | 51.6,31.5 50.88,30.78 C18.A 47.51,30.78 C6.1 | R17.2 43.81,14.76 C11.1 47.36,14.76 v47.7,15.1 47.7,8.8 47.27,8.38 IC4.3 44.88,8.38 v44.3,7.8 | R34.1 18.73,5.68 R25.1 19.6,6.5 v20.2,6.5 | v38.7,6.9 40.55,8.75 D5.1 40.55,8.05 v41.1,7.5 | R1.2 13.7,17.9 v14.1,18.3 | v27.6,15.2 27.7,15.1 v27.7,11.6 | v11.8,19.8 11,20.6 v11,21.9
  Bottom 0.305: v52.5,18.5 49.1,15.1 v47.7,15.1 | v20.2,6.5 20.6,6.9 24.7,6.9 | 24.7,6.9 v38.7,6.9 | v27.7,11.6 27.7,9.9 24.7,6.9 | v27.6,15.2 27.6,17.29 25,19.89 22.98,19.89 21.39,18.3 v14.1,18.3 13.3,18.3 v11.8,19.8 | v11,21.9 9.9,23 9.9,28.7 8.56,30.04 H1.13 | v44.3,7.8 44,7.5 v41.1,7.5
!ISO_K_TX
  Top 0.203: R13.2 37.57,23.4 35.1,23.4 28.7,17 18.4,17 16.92,15.52 IC1.22
!ISO_L_TX
  Top 0.203: R7.2 34.93,24.03 28.3,17.4 18.2,17.4 16.27,15.47 IC1.23
!ISO_RX  (via drill 0.51)
  Top 0.203: IC3.2 33.08,17.68 32.73,17.33 32.73,16.14 32.22,15.62 R9.1 32.13,15.13 31.9,14.9 29.9,14.9 v28.9,13.9 | IC1.8 13.02,7.92 v12.3,7.2
  Bottom 0.203: v12.3,7.2 17.4,12.3 27.3,12.3 v28.9,13.9
!OBD_RX_STATUS!/PGC
  Top 0.203: IC1.19 21.32,12.06 R4.1
!VPW_RX  (via drill 0.51)
  Top 0.203: R18.1 41.57,18.33 IC3.14 39.09,19.9 v38.3,19.9 | IC1.1 11.24,13.36 v10.7,13.9
  Bottom 0.203: v10.7,13.9 10.7,20.5 11,20.8 37.4,20.8 v38.3,19.9
BATT_V
  Top 0.305: IC1.27 13.67,14.93 13.41,15.19 12.82,15.19 12.43,15.57 R3.1 C7.1 R6.2
CAN_HI  (via drill 0.51)
  Top 0.203: IC4.7 52.95,9.64 53.2,9.9 53.2,11.3 52.6,11.9 51,11.9 49.9,13 49.9,17.8 49.1,18.6 46.5,18.6 45.8,19.3 45.8,21.2 44.88,22.12 R14.2 44.77,22.33 44,23.1 44,24.1 44.4,24.5 45.22,24.5 v45.6,24.88 | J1.6 23.2,36 23.2,34.7 26.2,31.7 36.4,31.7 v37.2,32.5
  Bottom 0.203: v37.2,32.5 41.2,32.5 42.1,33.4 43.7,33.4 46,31.1 46,25.28 v45.6,24.88
CAN_LO  (via drill 0.51)
  Top 0.203: IC4.6 52.98,8.38 53.6,9 53.6,11.5 52.7,12.4 51.2,12.4 50.3,13.3 50.3,18 49.2,19.1 46.8,19.1 46.4,19.5 46.4,21.3 47.6,22.5 47.6,27.3 47,27.9 45.2,27.9 44.88,27.58 R15.2 44.88,29.18 v45.1,29.4 | J1.14 22.3,33.9 23.3,33.9 26,31.2 v38.9,31.2
  Bottom 0.203: v38.9,31.2 40.7,31.2 42.4,32.9 43.4,32.9 45.1,31.2 v45.1,29.4
CAN_RX  (via drill 0.51)
  Top 0.203: IC1.11 14.97,5.02 v14.88,4.92 | v44.1,5.8 45.41,7.11 IC4.4
  Bottom 0.203: v14.88,4.92 43.22,4.92 v44.1,5.8
CAN_TX  (via drill 0.51)
  Top 0.203: IC1.12 15.72,8.31 15.72,3.97 R34.2 15.25,3.5 v13.9,3.5 | v40.8,4 40.8,5.8 43.6,8.6 43.6,10.3 44.22,10.91 IC4.1
  Bottom 0.203: v13.9,3.5 14.4,4 v40.8,4
GND  (via drill 0.51, 0.6)
  Top 0.203: IC1.24 15.62,12.06 IC1.EXP | IC1.EXP 16.27,10.11 IC1.16 18.05,10.05 18.4,10.05 18.67,9.78 18.67,9.51 20.8,7.38 22.49,7.38 | IC1.5 12.71,10.76 | 12.71,10.76 14.32,10.76 IC1.EXP | 6.45,9.47 7.38,8.53 7.38,5.96 7.02,5.6 C3.2 7.02,5.51 7.73,4.8 9.25,4.8 | 6.45,9.47 5.96,9.96 5.16,9.96 C2.2 | 22.49,7.38 22.49,6.4 D7.3 | 22.49,7.38 23.91,8.8 C4.C | 12.71,10.76 12.71,9.16 9.25,5.69 9.25,4.8 | C5.2 | v19.02,3.11 19.91,2.22 Q9.2 | v34.67,3.11 37.34,5.78 37.34,8.98 Q8.2 | 9.25,4.8 9.3,4.8 10.82,3.28 C5.2 | v6.49,9.51 6.45,9.47 | 44.81,30.23 44.09,29.52 44.09,26.76 44.27,26.58 45.52,26.58 46.05,27.11 46.23,27.11 C13.2 46.61,27.19 47.1,26.7 47.1,22.7 46.73,22.33 C12.2 | 44.81,30.23 45.43,30.23 46.05,29.6 46.05,29.43 46.67,28.8 C6.2 46.85,28.71 48.01,28.71 48.72,28 C18.C | 51.21,25.51 51.92,25.51 C8.2 | 51.21,25.51 48.81,27.91 C18.C | U1.2 52.54,30.67 52.54,30.32 49.52,27.29 C18.C | 52.18,22.31 52.01,22.49 52.01,23.47 C15.2 | 52.18,22.31 52.18,21.51 51.74,21.07 51.38,21.07 U3.2 | v53.25,14.94 53.25,15.91 C16.2 | v51.47,14.94 51.47,15.91 51.38,16 C10.2 | v44.63,20.36 44.63,19.91 46.94,17.6 48.01,17.6 C9.C | v52.63,22.31 52.18,22.31 | v49.34,23.56 51.21,25.43 51.21,25.51 | v29.78,10.22 30.76,10.22 R33.2 | v37.34,15.02 37.34,15.73 38.58,16.98 40.63,16.98 IC3.12 40.72,17.07 41.6,17.07 41.69,17.16 42.85,17.16 | 45.07,16.36 43.47,16.36 R23.1 | 45.07,16.36 45.34,16.09 C11.2 | 42.85,17.16 42.85,16.98 43.38,16.45 R23.1 | 42.85,17.16 42.85,19.47 42.67,19.65 41.43,19.65 40.27,20.8 R16.1 | 46.14,9.69 IC4.2 44.76,9.64 v44.5,9.9 | R23.1 43.38,16.36 42.85,15.82 42.85,14.49 43.38,13.96 43.38,13.9 43.38,13.52 v44.9,12
  Top 0.203: v45.25,17.16 45.25,16.62 45.07,16.45 45.07,16.36 | v32.54,24.45 33.16,23.82 34.05,23.82 34.31,24.09 34.31,25.16 35.2,26.05 Q3.2 | v35.38,22.58 37.96,22.58 39.38,24 39.38,25.16 39.12,25.43 39.12,26.05 Q4.2 | R6.1 9.96,17.16 11.11,17.16 C7.2 | C1.2 14.94,17.07 14.4,16.54 11.73,16.54 11.2,17.07 C7.2 | C7.2 11.11,17.25 11.11,17.96 12.8,19.65 12.8,21.78 C14.2 12.98,21.87 14.13,23.02 C17.2 14.13,23.11 13.51,23.74 13.51,26.23 14.13,26.85 R22.1 14.13,26.94 v14.13,28.89 | 44.81,30.23 44.81,30.94 42.23,33.52 40.54,33.52 39.56,34.49 39.56,37.78 37.78,39.56 30.76,39.56 29.25,38.05 J1.4 | C5.2 12.54,4.62 v13.07,4.62 | LED5.C 11.23,28.16 12.25,29.18 Q10.2 12.25,28.09 v12.34,28
  Bottom 0.203: v13.07,4.62 13.07,3.2 13.6,2.67 14.22,2.67 14.67,3.11 v19.02,3.11 v34.67,3.11 42.49,3.11 51.47,12.09 v51.47,14.94 v53.25,14.94 53.34,14.94 53.34,18.76 52.18,19.91 50.05,19.91 47.3,17.16 v45.25,17.16 44.09,17.16 43.56,17.69 43.56,18.67 44.63,19.74 v44.63,20.36 44.72,20.36 47.56,23.2 49.07,23.2 | v6.49,9.51 7.29,10.31 7.29,14.76 H1.1 | v52.63,22.31 50.05,22.31 49.16,23.2 49.07,23.2 | v49.34,23.56 49.07,23.29 49.07,23.2 | v29.78,10.22 32.54,10.22 v37.34,15.02 | v35.38,22.58 34.49,22.58 32.63,24.45 v32.54,24.45 32.54,33.52 30.76,35.29 30.76,36.45 29.25,37.96 J1.4 29.07,38.05 25.25,38.05 J1.5 25.16,37.96 25.16,37.16 22.76,34.76 22.76,34.4 17.6,29.25 14.22,29.25 v14.13,28.89 | 7.78,35.6 8.53,36.36 C25.- | 7.78,35.6 2.22,30.05 2.22,29.78 C26.2 2.22,29.69 3.02,28.89 3.02,23.02 1.87,21.87 1.87,20.98 H3.3 | v14.13,28.89 14.13,29.25 7.78,35.6 | v12.34,28 13.23,28.89 v14.13,28.89 | v44.5,9.9 44.5,11.6 v44.9,12
  other vias: 26.8,23.4 27.9,19.5 33.5,19.7 27.1,33 31.1,33.1 27.4,27.2 10.4,30.6
  pour Top (isolate 0.15): -2,-1 -2,40 0,42 55,42 58,39 58,-1 57,-2 55,-4 0,-4 -2,-2
  pour Bottom (isolate 0.015): -3,0 -3,43 -1,45 56,45 59,42 60,41 60,-4 58,-6 40,-6 3,-6
J1850BUS+  (via drill 0.51)
  Top 0.203: R30.1 26.5,7.08 26.5,9.3 26.7,9.5 27.46,9.5 D6.3 29.22,9.4 29.5,9.4 30,8.9 30,7 30.3,6.7 31.4,6.7 33.4,8.7 33.4,11.12 34.15,11.87 36.41,11.87 R28.1 R21.1 38.4,12.62 v38.4,15.7 | J1.2 39.2,36 39.2,34.2 41.6,31.8 v42.8,31.8
  Bottom 0.203: v42.8,31.8 42.8,21.7 38.4,17.3 v38.4,15.7
J1850BUS+_TX  (via drill 0.51)
  Top 0.203: IC1.3 10.64,12.06 9.8,12.9 4.8,12.9 3.8,11.9 3.8,8.7 4.36,8.14 4.7,8.14 5.1,7.74 5.1,3.7 v6.1,2.7 | Q9.1 17.93,2.3 v16.5,2.3
  Bottom 0.203: v6.1,2.7 6.5,2.3 v16.5,2.3
J1850BUS-  (via drill 0.51)
  Top 0.203: Q8.3 38.55,11.13 R31.2 40.42,12.1 42,12.1 v42.6,12.7 | J1.10 41.4,30.8 43.2,30.8 43.6,30.4 43.6,21.6 v43.9,21.3 43.7,21.5 | 36.46,11.1 36.45,11.11 Q8.3 | Q8.3 35.43,11.13 v35.4,11.1 | R29.1 30.83,7.78 v30.9,7.71
  Bottom 0.203: v43.9,21.3 42.6,20 v42.6,12.7 | v30.9,7.71 32.01,7.71 v35.4,11.1
J1850BUS-_TX
  Top 0.203: IC1.4 10.2,11.4 10,11.6 10,12.1 9.6,12.5 5,12.5 4.2,11.7 4.2,8.9 4.6,8.5 4.9,8.5 5.5,7.9 5.5,5.3 9.6,1.2 31.6,1.2 36.4,6 36.4,9.4 35.62,10.18 34.62,10.18 R32.1
K-LINE  (via drill 0.51)
  Top 0.203: Q4.3 39.19,29.31 R11.2 | J1.7 19.1,36.1 19.1,34.4 20.2,33.3 23.2,33.3 25.8,30.7 32.9,30.7 34.2,29.4 36.9,29.4 Q4.3 | Q4.3 36.29,28.21 v36.2,28.3 | v30,12.7 30,13.32 R12.1
  Bottom 0.203: v36.2,28.3 36.2,24.3 39.4,21.1 39.4,19.1 38.9,18.6 34,18.6 33.2,17.8 33.2,13.5 33.1,13.4 30.7,13.4 v30,12.7
L-LINE
  Top 0.203: Q3.3 33.18,29.31 R8.2 26.49,29.31 23,32.8 20,32.8 17.77,35.03 J1.15
N$1
  Top 0.203: IC3.7 34.03,14.43 33.7,14.1 33.7,12.9 34.03,12.57 R28.2
N$3
  Top 0.203: IC3.6 34.02,15.08 33.09,14.15 33.09,13.25 33,13.16 33,9.5 32.37,8.87 R29.2
N$4
  Top 0.203: Q4.1 37.14,24.87 R13.1
N$5
  Top 0.203: Q3.1 33.33,24.87 R7.1
N$6
  Top 0.203: IC3.5 34.16,15.73 32.73,14.3 32.73,13.4 31.4,13.4 30.83,12.83 R10.2 30.83,11.37 31.4,10.8 31.47,10.8 R33.1
N$7
  Top 0.203: IC3.8 41.37,14.43 41.6,14.2 41.6,12.9 41.27,12.57 R21.2
N$8
  Top 0.203: R19.2 R20.2 16.52,22.03 U2.1
N$9
  Top 0.203: Q7.3 27.34,7.76 D6.1
N$10
  Top 0.203: C12.1 R14.1
N$11
  Top 0.203: IC4.8 50.48,10.91 49.4,12 49.4,15.2 48.7,15.9 46.7,15.9 46.4,16.2 46.4,17.5 43.08,20.82 R16.2
N$12
  Top 0.203: IC3.9 42.13,15.08 R17.1 R23.2
N$13
  Top 0.203: IC3.4 33.68,16.38 32.73,15.43 32.73,14.87 32.13,14.26 R12.2
N$14
  Top 0.203: D5.3 40.53,11.03 39.7,10.2 39.7,9.6 39.48,9.38 R31.1
N$17
  Top 0.203: H3.4 3.2,19.78 3.2,23.4 H1.10
N$18
  Top 0.203: Q7.1 27.33,3.3 23.5,3.3 22.89,2.69 R24.2 21.38,2.42 19.55,4.25 Q9.3
N$20
  Top 0.203: H3.2 1.8,23.96 4.76,26.92 H1.12
N$22
  Top 0.203: Q10.3 13.25,29.13 13.25,27.24 R22.2 R19.1
N$24
  Top 0.203: D7.1 22.4,5.1 24.44,5.1 R30.2
N$25
  Top 0.203: Q8.1 34.47,9.03 R32.2
N$26
  Top 0.203: IC1.17 19.3,10.76 C4.A
N$27
  Top 0.203: R15.1 C13.1
N$30
  Top 0.203: R4.2 LED3.C
N$31
  Top 0.203: R5.1 LED4.C
N$32
  Top 0.203: LED5.A R2.1
N$34
  Top 0.203: C16.1 54.5,18.5 54.5,19.45 U3.4
N$35
  Top 0.203: R35.2 LED1.C
N$36
  Top 0.203: R37.1 LED2.C
OSC1
  Top 0.203: IC1.6 11.11,10.11 10.3,9.3 8.39,9.3 Y1.3 6.43,11.26 C2.1
OSC2
  Top 0.203: IC1.7 10,7.49 Y1.1 8.8,6.03 C3.1
PWM/!VPW
  Top 0.203: Q10.1 9.5,28.43 9.5,18 9,17.5 9,15.2 9.4,14.8 12.63,14.8 IC1.28
PWM_RX  (via drill 0.51)
  Top 0.203: IC3.1 33.03,18.33 32.13,17.43 | 32.13,17.43 R27.1 | IC1.2 10.69,12.71 9.74,13.66 v9,13.66 | v31.5,18.5 32.13,17.87 32.13,17.43
  Bottom 0.203: v9,13.66 9.86,12.8 26.5,12.8 31.5,17.8 v31.5,18.5
RESET
  Top 0.203: IC1.26 14.32,15.22 R1.1
RST_NVM
  Top 0.203: IC1.18 R5.2
RX-I  (via drill 0.51)
  Top 0.203: IC1.13 16.27,6.83 v16.7,6.4
  Bottom 0.203: H1.2 4.46,14.5 4.46,6.54 5.3,5.7 16,5.7 v16.7,6.4
RX-STAT
  Top 0.203: IC1.21 20.08,13.36 R35.1
TX-O  (via drill 0.51)
  Top 0.203: IC1.14 16.92,7.48 17.42,6.98 R25.2 16.09,4.29 16.09,3.19 15.51,2.6 9.3,2.6 v8.2,3.7
  Bottom 0.203: v8.2,3.7 6.7,3.7 3.3,7.1 3.3,16.3 4.34,17.34 H1.4
TX-STAT
  Top 0.203: IC1.20 20.7,12.71 R37.2
VBAT  (via drill 0.51)
  Top 0.305: IC3.3 36.03,17.03 v36.5,17.5 36.5,20.8 36.9,21.2 38.19,21.2 R11.1 41.9,26.3 41,27.2 31.7,27.2 30.47,25.97 R8.1 24.75,24.91 D1.C 21.08,21.68 U2.3 18.99,19.1 15.5,19.1 14.2,20.4 C14.1 | 31.9,11.64 R10.1 31.94,11.6 v31.94,12.54
  Bottom 0.305: v36.5,17.5 36.5,14.8 34.24,12.54 v31.94,12.54
VBATT_RAW  (via drill 0.51)
  Top 0.305: v23.5,22 23.5,20.41 21.7,18.61 15.19,18.61 14.2,19.6 13.43,19.6 12.43,18.6 R3.2 | H3.1 3.3,27.5 3.3,30.9 4.1,31.7 9.2,31.7 10.5,33 11.14,33 J1.16 16.1,32.1 22.3,32.1 22.8,31.6 v22.8,30.4 23.56,30.4 D1.A
  Bottom 0.305: v23.5,22 22.8,22.7 v22.8,30.4
VCC  (via drill 0.51)
  Top 0.305: U3.1 50.35,21.95 49.9,21.5 49.9,20.4 50.25,20.05 U3.3 | U3.3 51.3,20.01 v50.39,19.1 49.09,20.4 C9.A | U3.3 51.33,20.02 C10.1 52.05,17.35 52.3,17.1 52.3,13.5 54.2,11.6 54.2,6.4 53.3,5.5 45.8,5.5 42.8,2.5 35.6,2.5 33.85,0.75 5.85,0.75 4.65,1.95 4.65,3.42 2.7,5.37 2.7,17.1 4.2,18.6 8.3,18.6 8.7,19 8.7,30.2 10.7,32.2 13.1,32.2 13.9,31.4 | R24.1 28.35,2.42 Q7.2 33.8,7.87 v33.8,7.9 | R20.1 C17.1 12.84,23.14 R2.2 10.97,23.14 10.41,23.7 10.41,28.76 11.85,30.2 13.1,30.2 13.5,30.6 13.5,31 13.9,31.4 | U2.4 15.77,31.4 13.9,31.4
  Bottom 0.305: v33.8,7.9 35.7,9.8 41.3,9.8 45.4,13.9 45.4,14.11 v50.39,19.1

### Text on the board
tPlace: SAYMOSTHASFAR | RX | TX | OBDRX | OBDTX